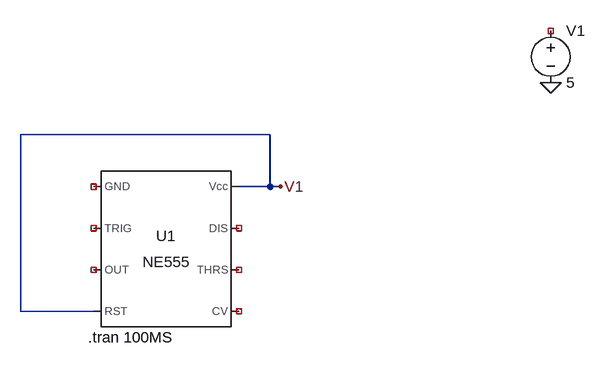
[diagram p0: schematic MONOSTABLE.asc]
MONOSTABLE.asc, the LTspice schematic file:
Version 4
SHEET 1 880 680
WIRE 384 0 0 0
WIRE 384 80 384 0
WIRE 384 80 336 80
WIRE 400 80 384 80
WIRE 0 272 0 0
WIRE 112 272 0 272
FLAG 816 -80 0
FLAG 400 80 V1
SYMBOL Misc\\NE555 224 176 R0
SYMATTR InstName U1
SYMBOL voltage 816 -176 R0
WINDOW 123 0 0 Left 0
WINDOW 39 0 0 Left 0
SYMATTR InstName V1
SYMATTR Value 5
TEXT 104 312 Left 2 !.tran 100MS

The netlist it stands for:
* MONOSTABLE.asc
XU1 NC_01 NC_02 NC_03 V1 NC_04 NC_05 NC_06 V1 NE555  ; pins GND TRIG OUT RST CV THRS DIS Vcc
V1 NC_07 0 5
.tran 100MS
.lib NE555.sub
.backanno
.end